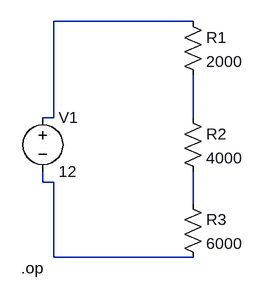
[diagram p0: schematic circuit.asc]
circuit.asc, the LTspice schematic file:
Version 4.1
SHEET 1 880 680
WIRE 96 64 -112 64
WIRE -112 208 -112 64
WIRE -112 208 -128 208
WIRE 96 208 96 144
WIRE -128 304 -128 288
WIRE -112 304 -128 304
WIRE 96 336 96 288
WIRE -112 416 -112 304
WIRE 96 416 -112 416
DATAFLAG -112 64 ""
DATAFLAG 96 64 ""
DATAFLAG 96 176 ""
DATAFLAG 96 320 ""
SYMBOL res 80 48 R0
SYMATTR InstName R1
SYMATTR Value 2000
SYMBOL res 80 192 R0
SYMATTR InstName R2
SYMATTR Value 4000
SYMBOL res 80 320 R0
SYMATTR InstName R3
SYMATTR Value 6000
SYMBOL voltage -128 192 R0
SYMATTR InstName V1
SYMATTR Value 12
TEXT -160 432 Left 2 !.op

The netlist it stands for:
* circuit.asc
R1 N001 N002 2000
R2 N002 N004 4000
R3 N004 N003 6000
V1 N001 N003 12
.op
.backanno
.end